# Altium schematic sheet PowerSupply.SchDoc
size A4
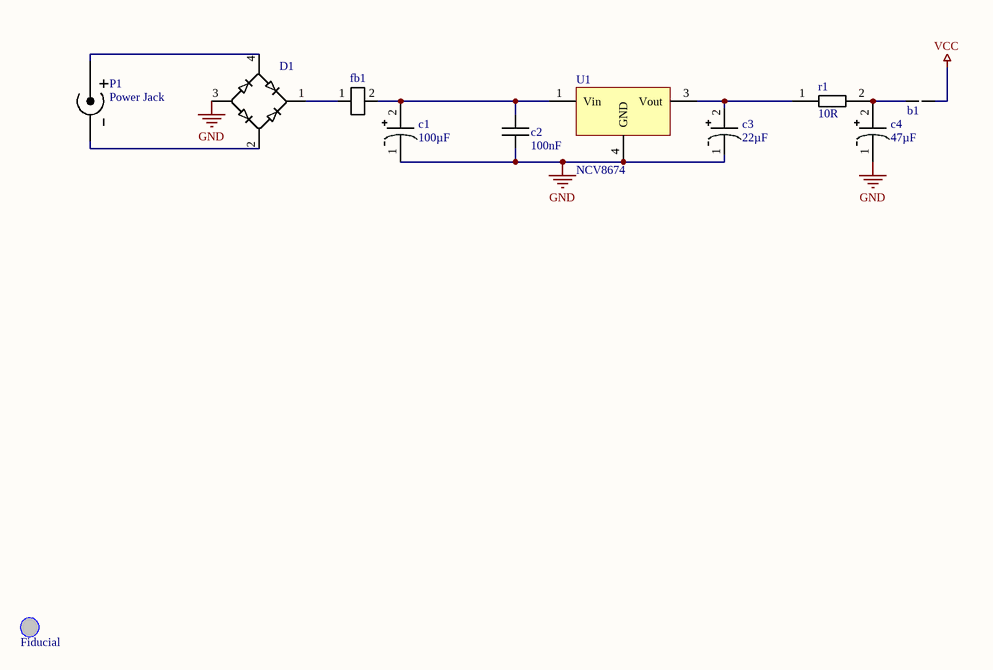
[diagram p0: PowerSupply.SchDoc]

## Parts
b1  Solder Bridge  [Solder Bridge]  (value not drawn)
c1  100µF  [Elco-D]
c2  100nF  [0805]
c3  22µF  [Elco-D]
c4  47µF  [Elco-D]
D1  Bridge Rectifier  [SOT-143]  (value not drawn)
f1  Fiducial  [Fiducial]
fb1  *  [0805]  (value not drawn)
P1  Power Jack  [Power Jack]
r1  10R  [0805]
U1  NCV8674  [D²PAK 3]

## Nets
GND: c1.1 c2.1 c3.1 c4.1 D1.3 U1.4(GND)
VCC: b1.2
Netb1_1: b1.1 c4.2 r1.2
Netc1_2: c1.2 c2.2 fb1.2 U1.1(Vin)
Netc3_2: c3.2 r1.1 U1.3(Vout)
NetD1_1: D1.1 fb1.1
NetD1_2: D1.2 P1.2(GND)
NetD1_4: D1.4 P1.1(V+)

## Library data of the parts
c1 c3 c4 = Elco D: Elco size D 6.3x5.4
c2 = 0805 Capacitor: ...F
fb1 = Ferrite Bead 0805 Package: Ferrite Bead
P1 = DC Power Jack
r1 = 0805 Resistor: 0805 Resistor package
U1 = NCV8674: Very Low Iq Low Dropout Linear Regualtor